# Altium schematic sheet OutputDigital.SchDoc
size A4; SheetNumber: 4; SheetTotal: 4
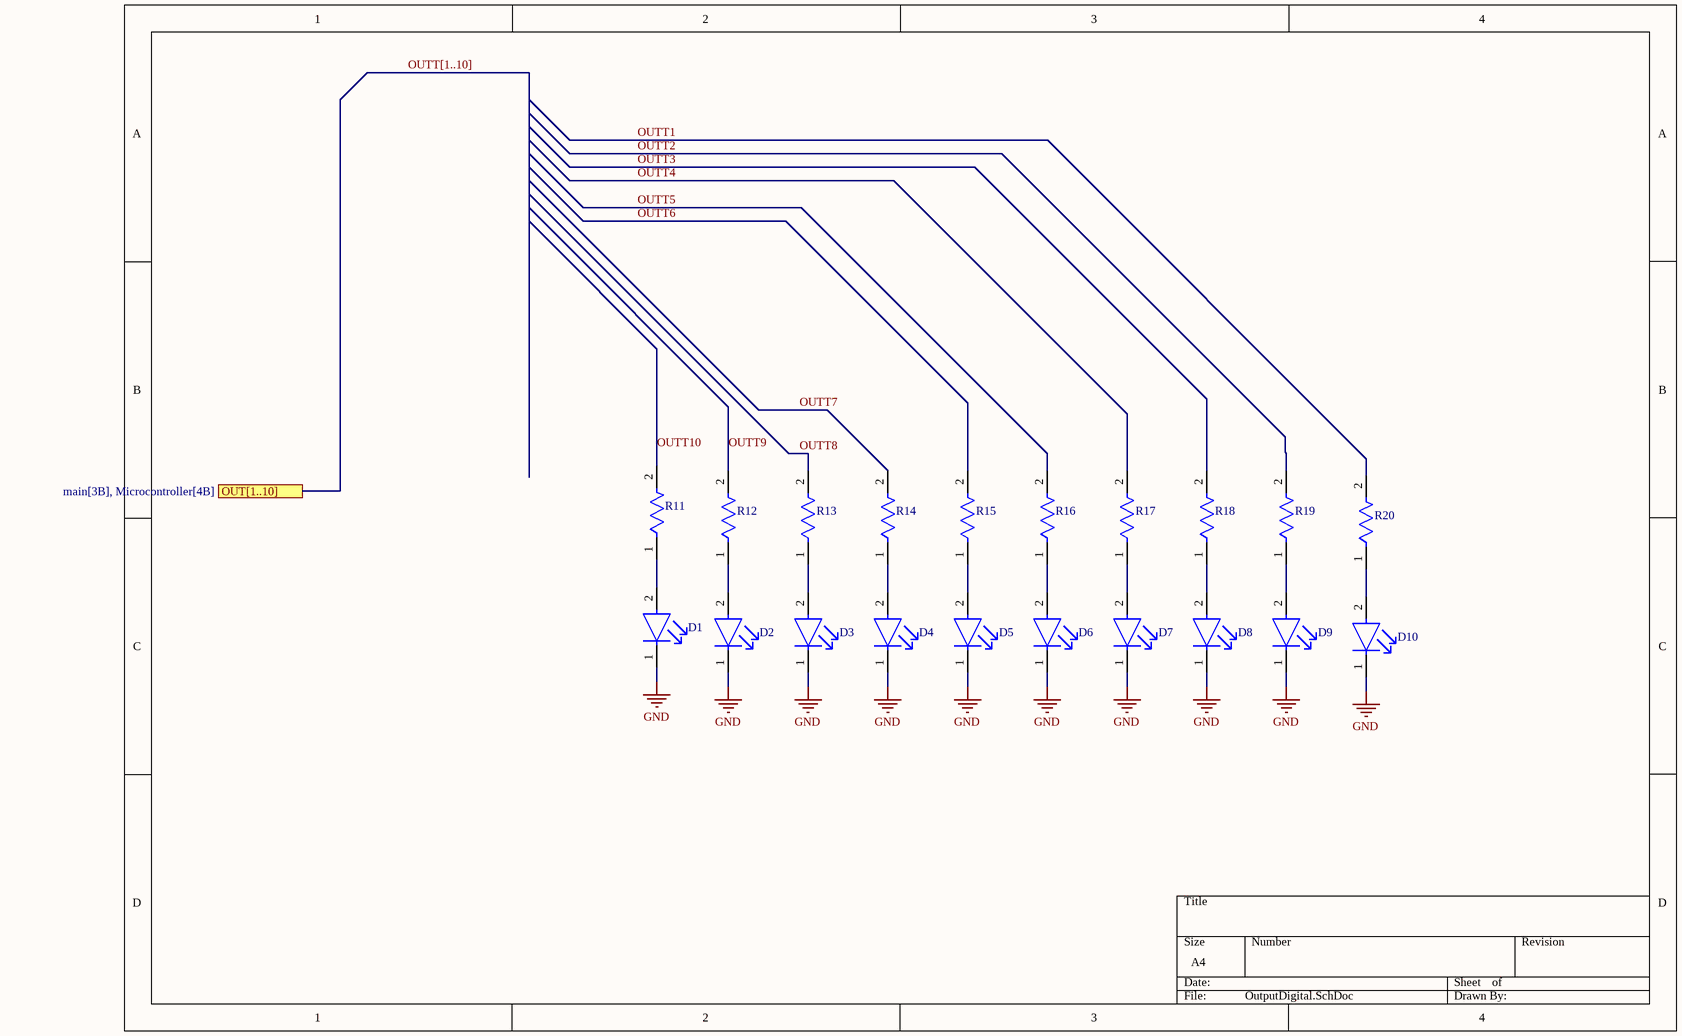
[diagram p0: OutputDigital.SchDoc]

## Parts
D1  LTST-C230KRKT  [FP-LTST-C230KRKT-MFG]  (value not drawn)
D2  LTST-C230KRKT  [FP-LTST-C230KRKT-MFG]  (value not drawn)
D3  LTST-C230KRKT  [FP-LTST-C230KRKT-MFG]  (value not drawn)
D4  LTST-C230KRKT  [FP-LTST-C230KRKT-MFG]  (value not drawn)
D5  LTST-C230KRKT  [FP-LTST-C230KRKT-MFG]  (value not drawn)
D6  LTST-C230KRKT  [FP-LTST-C230KRKT-MFG]  (value not drawn)
D7  LTST-C230KRKT  [FP-LTST-C230KRKT-MFG]  (value not drawn)
D8  LTST-C230KRKT  [FP-LTST-C230KRKT-MFG]  (value not drawn)
D9  LTST-C230KRKT  [FP-LTST-C230KRKT-MFG]  (value not drawn)
D10  LTST-C230KRKT  [FP-LTST-C230KRKT-MFG]  (value not drawn)
R11  RT0805BRD07249RL  [FP-RT0805-MFG]  (value not drawn)
R12  RT0805BRD07249RL  [FP-RT0805-MFG]  (value not drawn)
R13  RT0805BRD07249RL  [FP-RT0805-MFG]  (value not drawn)
R14  RT0805BRD07249RL  [FP-RT0805-MFG]  (value not drawn)
R15  RT0805BRD07249RL  [FP-RT0805-MFG]  (value not drawn)
R16  RT0805BRD07249RL  [FP-RT0805-MFG]  (value not drawn)
R17  RT0805BRD07249RL  [FP-RT0805-MFG]  (value not drawn)
R18  RT0805BRD07249RL  [FP-RT0805-MFG]  (value not drawn)
R19  RT0805BRD07249RL  [FP-RT0805-MFG]  (value not drawn)
R20  RT0805BRD07249RL  [FP-RT0805-MFG]  (value not drawn)

## Ports
OUT[1..10] (see main[3B], Microcontroller[4B])

## Nets
GND: D1.1(C) D2.1(C) D3.1(C) D4.1(C) D5.1(C) D6.1(C) D7.1(C) D8.1(C) D9.1(C) D10.1(C)
OUTT1: R20.2
OUTT2: R19.2
OUTT3: R18.2
OUTT4: R17.2
OUTT5: R16.2
OUTT6: R15.2
OUTT7: R14.2
OUTT8: R13.2
OUTT9: R12.2
OUTT10: R11.2
NetD1_2: D1.2(A) R11.1
NetD2_2: D2.2(A) R12.1
NetD3_2: D3.2(A) R13.1
NetD4_2: D4.2(A) R14.1
NetD5_2: D5.2(A) R15.1
NetD6_2: D6.2(A) R16.1
NetD7_2: D7.2(A) R17.1
NetD8_2: D8.2(A) R18.1
NetD9_2: D9.2(A) R19.1
NetD10_2: D10.2(A) R20.1

## Buses and harness runs
bus OUTT[1..10] = port OUT[1..10]

## Library data of the parts
D1-D10 = CMP-22017-000041-1: LED RED CLEAR CHIP SMD; Dominant Wavelength: 631nm; Lens Color: Colorless; Lens Style: Diffused; Forward Voltage: 2V; Test Current: 20mA; Luminous Intensity: 54mcd; Number of LEDs: 1; Viewing Angle: 130°; Power Rating: 75mW; Forward Current: 30mA; Wavelength: 639nm; Reverse Voltage: 5V; Min Operating Temperature: -55°C; Height: 1.1mm; Length: 3.2mm; Lens Transparency: Clear; Case/Package: 1206; Package Quantity: 1; Width: 1.6mm; Max Operating Temperature: 85°C; Packaging: Tape and Reel; RoHS Compliant: Yes; Mount: Surface Mount; Lead Free: Lead Free; Depth: 1.6mm; Power Dissipation: 75mW; Number of Pins: 2; Number of Elements: 1; Color: Red; Illumination Color: Red; Case Code (Imperial): 1206; Case Code (Metric): 3216; Radiation Hardening: No
R11-R20 = CMP-03412-035801-1: RES SMD 249 OHM 0.1% 1/8W 0805; Manufacturer: Yageo; Power Rating: 0.125W; Voltage Rating: 150V; Value: 249Ω; Temperature Coefficient: 25 ppm/°C; Tolerance: 0.0025; Device Class L2: Resistors; Composition: Thin Film; RoHS: TRUE; Digikey Description: RES SMD 249 OHM 0.1% 1/8W 0805; Octopart: https://octopart.com/rt0805brd07249rl-yageo-1410573; Temperature Range Low: -55°C; Ipc Land Pattern Name: RESC200125X50; Device Class L3: Chip SMD Resistors; Category: Res; Automotive: No; ComponentLink2Description: Datasheet; Manufacturer Part Number: RT0805BRD07249RL; Temperature: -55°C to +155°C; Height: 0.6mm; Mouser Description: Res SMD 249 Ohm .1% 0805; Resistance: 249Ω; ComponentLink2URL: http://www.yageo.com/documents/recent/PYu-RT_1-to-0.01_RoHS_L_9.pdf; Lead Free: Yes; Package: RT0805; Series: RT; Temperature Range High: +155°C; Footprint Url: http://www.yageo.com/exep/pages/download/literatures/PYu-R_Mount_10.pdf; Device Class L1: Passive Components